# Altium schematic sheet i2c_dev_blk.SchDoc
size A4; Engineer: JBayalas; DocumentNumber: 10; Revision: V4.3.0; SheetNumber: 10; SheetTotal: 12
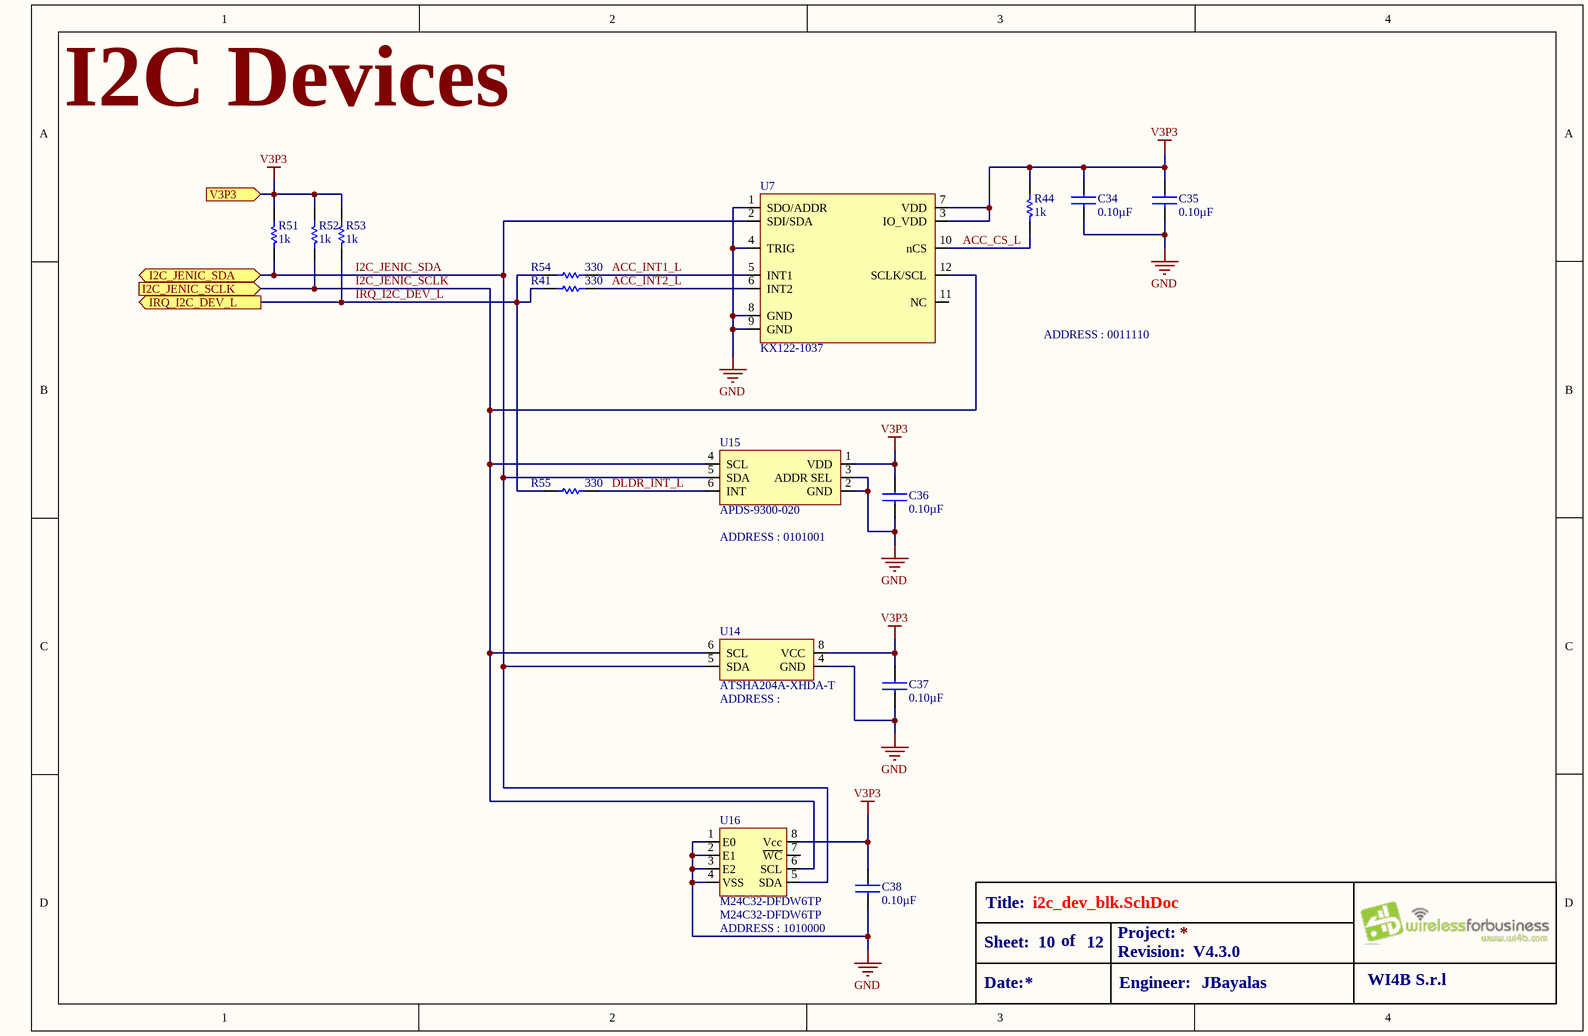
[diagram p0: i2c_dev_blk.SchDoc]

## Parts
C34  value 0.10µF  [C0402]  (hidden comment: GRM155R71H104ME14D)
C35  value 0.10µF  [C0402]  (hidden comment: GRM155R71H104ME14D)
C36  value 0.10µF  [C0402]  (hidden comment: GRM155R71H104ME14D)
C37  value 0.10µF  [C0402]  (hidden comment: GRM155R71H104ME14D)
C38  value 0.10µF  [C0402]  (hidden comment: GRM155R71H104ME14D)
R41  value 330  [R0402]  (hidden comment: CRCW0402330RFKED)
R44  value 1k  [R0402]  (hidden comment: MCS04020C1001FE000)
R51  value 1k  [R0402]  (hidden comment: MCS04020C1001FE000)
R52  value 1k  [R0402]  (hidden comment: MCS04020C1001FE000)
R53  value 1k  [R0402]  (hidden comment: MCS04020C1001FE000)
R54  value 330  [R0402]  (hidden comment: CRCW0402330RFKED)
R55  value 330  [R0402]  (hidden comment: CRCW0402330RFKED)
U7  KX122-1037  [KX122-1037]
U14  ATSHA204A-XHDA-T  [TSSOP-8 (wide Body)]
U15  APDS-9300-020  [APDS-9300-020]
U16  M24C32-DFDW6TP  [8-TSSOP]

## Ports
I2C_JENIC_SCLK (in), I2C_JENIC_SDA (bidir), IRQ_I2C_DEV_L (out), V3P3 (in)

## Nets
GND: C34.2 C35.2 C36.2 C37.2 C38.2 U7.1(SDO/ADDR) U7.4(TRIG) U7.8(GND) U7.9(GND) U14.4(GND) U15.2(GND) U15.3(ADDR_SEL) U16.1(E0) U16.2(E1) U16.3(E2) U16.4(VSS)
V3P3: C34.1 C35.1 C36.1 C37.1 C38.1 R44.2 R51.2 R52.2 R53.2 U7.3(IO_VDD) U7.7(VDD) U14.8(VCC) U15.1(VDD) U16.8(Vcc) ; port V3P3
ACC_CS_L: R44.1 U7.10(nCS)
ACC_INT1_L: R54.1 U7.5(INT1)
ACC_INT2_L: R41.1 U7.6(INT2)
DLDR_INT_L: R55.1 U15.6(INT)
I2C_JENIC_SCLK: R52.1 U7.12(SCLK/SCL) U14.6(SCL) U15.4(SCL) U16.6(SCL) ; port I2C_JENIC_SCLK
I2C_JENIC_SDA: R51.1 U7.2(SDI/SDA) U14.5(SDA) U15.5(SDA) U16.5(SDA) ; port I2C_JENIC_SDA
IRQ_I2C_DEV_L: R41.2 R53.1 R54.2 R55.2 ; port IRQ_I2C_DEV_L

Not connected (* = marked no-connect by the designer): U7 11(NC); U16 7(~{WC})

## Notes on the sheet
- I2C Devices
- ADDRESS : 0011110
- (near U15) ADDRESS : 0101001
- (near U14) ADDRESS :
- ADDRESS : 1010000
- Title:
- Sheet:
- Date:
- of
- Project:
- Revision:
- Engineer:
- WI4B S.r.l

## Library data of the parts
C34-C38 = GRM155R71H104ME14D: CAP CER 0.1UF 50V X7R 0402; MFT: Murata Electronics North America; TYPE: SMD; FUNCTION: I2C Devices; MPN: GRM155R71H104ME14D; RATING: 50V; DNP: *
R41 R54 R55 = CRCW0402330RFKED: RES SMD 330 OHM 1% 1/16W 0402; MFT: Vishay Dale; FUNCTION: I2C Devices; MPN: CRCW0402330RFKED; TYPE: SMD; RATING: 1/16W; DNP: *
R44 R51-R53 = MCS04020C1001FE000: RES SMD 1K OHM 1% 1/10W 0402; MFT: Vishay Beyschlag; FUNCTION: I2C Devices; MPN: MCS04020C1001FE000; TYPE: SMD; RATING: 1/10W; DNP: *
U7 = KX122-1037: ACCELEROMETER 2-8G I2C/SPI 12LGA; MFT: Kionix Inc.; FUNCTION: I2C Devices; LOAD: *; RATING: *; TYPE: SMD; VALUE: KX122-1037; MPN: KX122-1037
U14 = ATSHA204A-XHDA-T: IC AUTHENTICATION CHIP 8TSSOP; MFT: Microchip Technology; FUNCTION: I2C Devices; LOAD: *; TYPE: SMD; RATING: *; VALUE: ATSHA204A-XHDA-T; MPN: ATSHA204A-XHDA-T
U15 = APDS-9300-020: IC SENSOR AMBIENT LIGHT 6CHIPLED; MFT: Broadcom Limited; FUNCTION: I2C Devices; LOAD: *; TYPE: SMD; RATING: *; VALUE: APDS-9300-020; MPN: APDS-9300-020
U16 = M24C32-DFDW6TP: IC EEPROM 32KBIT 400KHZ 8TSSOP; MFT: STMicroelectronics; FUNCTION: I2C Devices; TYPE: SMD; VALUE: M24C32-DFDW6TP; RATING: *; LOAD: *; MPN: M24C32-DFDW6TP